# EAGLE schematic os30_master (EAGLE 7.7.0)
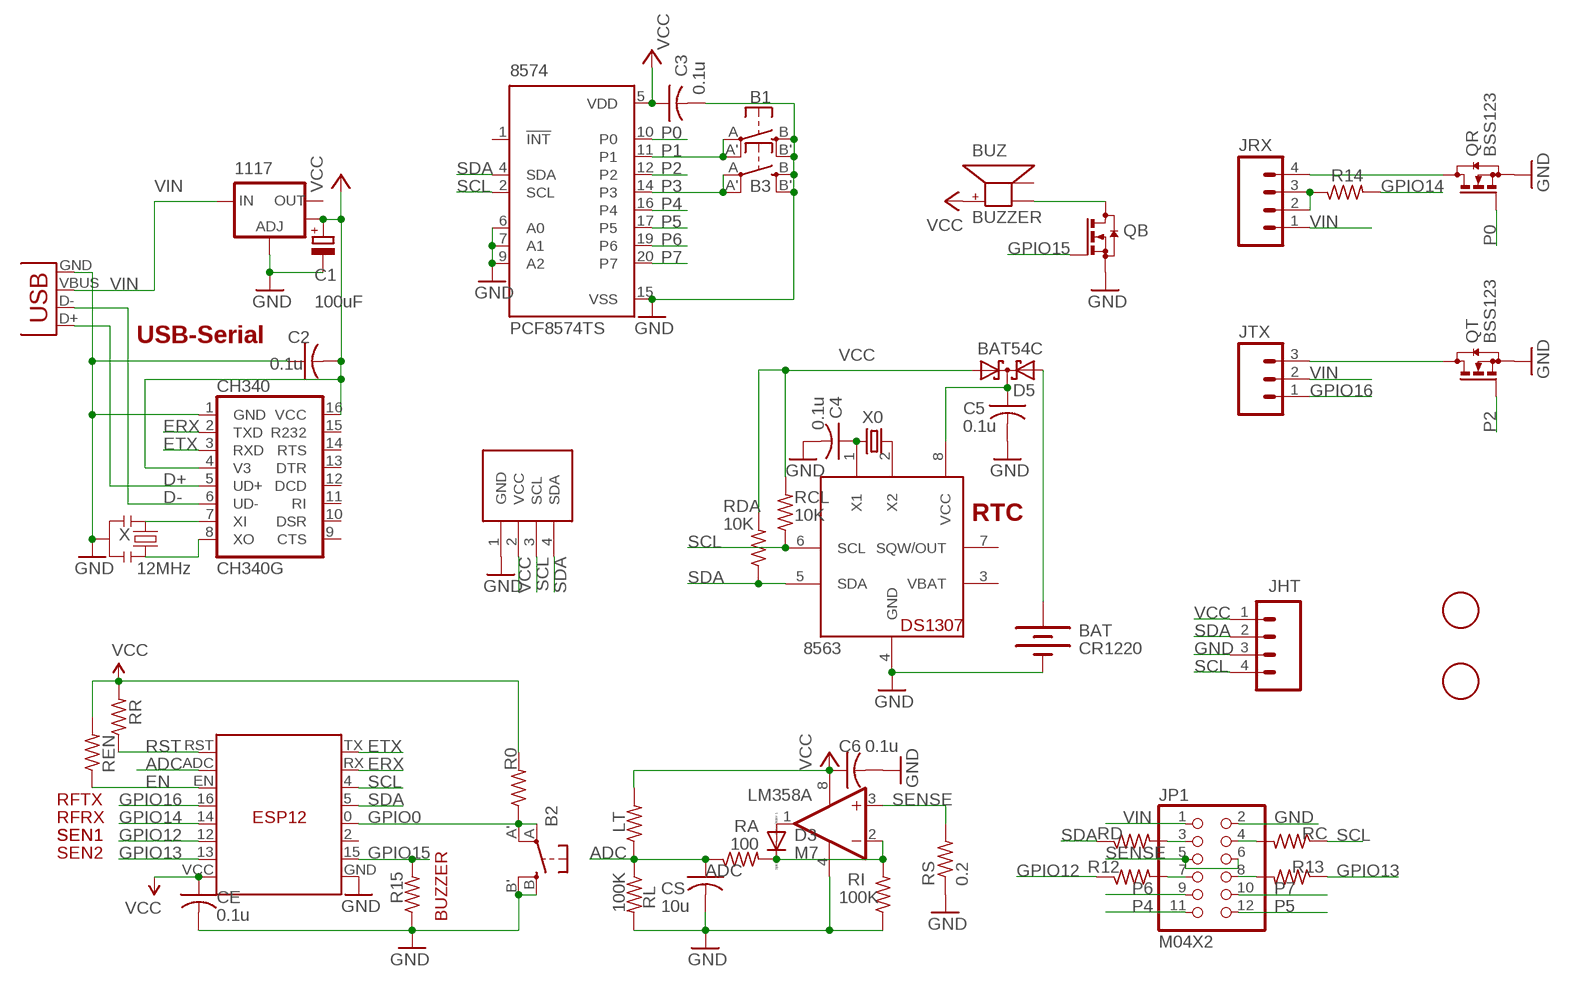
[diagram p0: schematic, sheet 1]

## Parts
1117  V_REG_LM1117SOT223  [SOT223]
8563  PCF8563  DS1307SOIC  [SO08]
8574  PCF8574TS  [SSOP20]
B1  SPST_TACT-EVQQ2  [EVQ-Q2]
B2  SPST_TACT-EVQQ2  [EVQ-Q2]
B3  SPST_TACT-EVQQ2  [EVQ-Q2]
BAT  CR1220  BATTERYBATTERY_12MM_SMT  [BATTCON_12MM_SMT]
BUZ  BUZZER  [SMT-8585-BUZZER]
C1  100uF  CPOL-EUD  [PANASONIC_D]
C2  0.1u  C-USC0603  [C0603]
C3  0.1u  C-USC0603  [C0603]
C4  0.1u  C-USC0603  [C0603]
C5  0.1u  C-USC0603  [C0603]
C6  0.1u  C-USC0603  [C0603]
CE  0.1u  C-USC0603  [C0603]
CH340  CH340G  [SO16]
CS  10u  C-USC0805K  [C0805K]
D3  M7  DIODE-DO-214AC  [DO-214AC]
D5  BAT54C  [SOT23]
ESP  ESP  ESP12ESPWES  [ESP12_WES]
JHT  M04NARROW  [1X04-NARROW]
JP1  M04X2  PINHD-2X6  [2X06]
JRX  M04PTH  [1X04]
JTX  M03PTH  [1X03]
LCD  SSD1306_OLED_I2CSMD3  [SSD1306_OLED_I2C_SMD3]
LM358  OP262D  [SO08]
LT  100K  R-US_R1206  [R1206]
QB  AO3400  BSS123  [SOT23]
QR  BSS123  [SOT23]
QT  BSS123  [SOT23]
R0  10k  R-US_R0603  [R0603]
R12  4.7k  R-US_R0603  [R0603]
R13  4.7k  R-US_R0603  [R0603]
R14  1K  R-US_R0603  [R0603]
R15  10K  R-US_R0603  [R0603]
RA  100  R-US_R0603  [R0603]
RC  4.7k  R-US_R0603  [R0603]
RCL  10K  R-US_R0603  [R0603]
RD  330  R-US_R0603  [R0603]
RDA  10K  R-US_R0603  [R0603]
REN  10k  R-US_R0603  [R0603]
RI  100K  R-US_R0603  [R0603]
RL  100K  R-US_R0603  [R0603]
RR  10k  R-US_R0603  [R0603]
RS  0.2  R-US_R2512  [R2512]
U$1  FIDUCIAL  [FIDUCIAL_1MM]
U$2  FIDUCIAL  [FIDUCIAL_1MM]
USB  USBMICROB2  [USB-MICROB2]
X  12MHz  RESONATORSMD  [RESONATOR-SMD]
X0  32.768kHz  CRYSTALMM20SS1  [MM20SS1]

## Nets
ADC: CS.1 ESP.ADC LT.1 RA.1 RL.1
D+: CH340.5(UD+) USB.D+
D-: CH340.6(UD-) USB.D-
EN: ESP.EN REN.1
ERX: CH340.2(TXD) ESP.RX
ETX: CH340.3(RXD) ESP.TX
GND [power]: 1117.1(ADJ) 8563.4(GND) 8574.6(A0) 8574.7(A1) 8574.9(A2) 8574.15(VSS) B1.B'(S1) B1.B(S) B2.B'(S1) B2.B(S) B3.B'(S1) B3.B(S) BAT.P$1(-) C1.- C2.1 C3.2 C4.2 C5.2 C6.2 CE.2 CH340.1(GND) CS.2 ESP.GND JHT.3 JP1.2 LCD.1(GND) LM358.4(P:V-) QB.2(S) QR.2(S) QT.2(S) R15.1 RI.1 RL.2 RS.1 USB.GND X.2
GPIO0: B2.A'(P1) B2.A(P) ESP.0(G0) R0.1
GPIO12: ESP.12(G12) R12.1
GPIO13: ESP.13(G13) R13.1
GPIO14: ESP.14(G14) R14.2
GPIO15: ESP.15(G15) QB.1(G) R15.2
GPIO16: ESP.16(G16) JTX.1
N$1: 8563.1(X1) C4.1 X0.1
N$2: BUZ.- QB.3(D)
N$3: JP1.3 RD.2
N$4: JP1.4 RC.2
N$5: JP1.7 R12.2
N$6: JP1.8 R13.2
N$7: D3.C LM358.2(A:-IN) RA.2 RI.2
N$17: 8563.8(VCC) C5.1 D5.3(CC)
N$24: CH340.7(XI) X.1
N$26: JRX.2 JRX.3 R14.1
N$28: JTX.3 QT.3(D)
N$29: JRX.4 QR.3(D)
N$30: 8563.2(X2) X0.4
N$36: BAT.P$2(+) D5.2(A2)
N$40: CH340.8(XO) X.3
N$43: D3.A LM358.1(A:OUT)
P0: 8574.10(P0) QR.1(G)
P1: 8574.11(P1) B1.A'(P1) B1.A(P)
P2: 8574.12(P2) QT.1(G)
P3: 8574.14(P3) B3.A'(P1) B3.A(P)
P4: 8574.16(P4) JP1.11
P5: 8574.17(P5) JP1.12
P6: 8574.19(P6) JP1.9
P7: 8574.20(P7) JP1.10
RST: ESP.RST RR.1
SCL: 8563.6(SCL) 8574.2(SCL) ESP.4(G4) JHT.4 LCD.3(SCL) RC.1 RCL.1
SDA: 8563.5(SDA) 8574.4(SDA) ESP.5(G5) JHT.2 LCD.4(SDA) RD.1 RDA.1
SENSE [relaypower]: JP1.5 JP1.6 LM358.3(A:+IN) RS.2
VCC: 1117.4(OUT) 8574.5(VDD) BUZ.+ C1.+ C2.2 C3.1 C6.1 CE.1 CH340.4(V3) CH340.16(VCC) D5.1(A1) ESP.VCC JHT.1 LCD.2(VCC) LM358.8(P:V+) LT.2 R0.2 RCL.2 RDA.2 REN.2 RR.2
VIN [power]: 1117.3(IN) JP1.1 JRX.1 JTX.2 USB.VBUS
Unconnected: 1117.2(OUT) 8563.7(SQW/OUT) 8574.1(!INT) BUZ.A- CH340.9(CTS) CH340.10(DSR) CH340.11(RI) CH340.12(DCD) CH340.13(DTR) CH340.14(RTS) CH340.15(R232) ESP.2(G2) LM358.5(B:+IN) LM358.6(B:-IN) LM358.7(B:OUT)

## Notes on the sheet
- USB-Serial
- RTC
- RFTX
- RFRX
- SEN1 | SEN1
- SEN2
- BUZZER

## Power pins joined to a net without a drawn wire
VBAT: 8563.3(VBAT)

## Library data of the parts
1117 = SparkFun:V_REG_LM1117: Voltage Regulator LM1117 Standard adjustable voltage regulator but in SMD form. Spark Fun Electronics SKU : COM-00595
8563 = adafruit:DS1307: DS1307 Real time clock (RTC) with battery backup ability. Talk to it via i2c
8574 = micro-philips:PCF8574: I2C-Bus Remote 8-bit I/O expander http://www.semiconductors.philips.com/acrobat_download/datasheets/PCF8574_4.pdf; MPN: PCF8574TS/3,118; OC_FARNELL: 1506644; OC_NEWARK: 70R6873
B1-B3 = adafruit_3:SPST_TACT: SMT 6mm switch, EVQQ2 series http://www.ladyada.net/library/eagle
BAT = SparkFunNew:BATTERY: Battery Holders Various common sizes : AA, AAA, 20mm coin cell and 12mm coin cell.
BUZ = adafruit:BUZZER
C1 = resistor:CPOL-EU: POLARIZED CAPACITOR, European symbol
C2-C6 CE CS = adafruit:C-US: CAPACITOR, American symbol
CH340 = SparkFunNew:CH340
D3 = diode:DIODE-: DIODE
D5 = diode:BAT54C: Schottky Diodes Source: Fairchild .. BAT54.pdf
ESP = JeeParts:ESP12
JHT JRX = SparkFun:M04: Header 4 Standard 4-pin 0.1" header. Use with straight break away headers (SKU : PRT-00116), right angle break away headers (PRT-00553), swiss pins (PRT-00743), machine pins (PRT-00117), and female headers (PRT-00115). Molex polarized connector foot print use with SKU : PRT-08231 with associated crimp pins and housings.
JP1 = pinhead:PINHD-2X6: PIN HEADER
JTX = SparkFun:M03: Header 3 Standard 3-pin 0.1" header. Use with straight break away headers (SKU : PRT-00116), right angle break away headers (PRT-00553), swiss pins (PRT-00743), machine pins (PRT-00117), and female headers (PRT-00115). Molex polarized connector foot print use with SKU : PRT-08232 with associated crimp pins and housings.
LCD = adafruit2013:SSD1306_OLED_I2C
LM358 = linear:OP262: OP AMP
LT R15 RA RCL RDA RI RL RS = adafruit2013:R-US_: RESISTOR, American symbol
QB QR QT = transistor-small-signal:BSS123: N-CHANNEL MOS FET
R0 REN RR = adafruit:R-US_: RESISTOR, American symbol
R12-R14 RC RD = adafruitGood:R-US_: RESISTOR, American symbol
U$1 U$2 = adafruitGood:FIDUCIAL: For use by pick and place machines to calibrate the vision/machine, 1mm By microbuilder.eu
USB = SparkFunNew:USB: USB Connectors USB-B-PTH is fully proven SKU : PRT-00139 USB-miniB is fully proven SKU : PRT-00587 USB-A-PCB is untested. USB-A-H is throughly reviewed, but untested. Spark Fun Electronics SKU : PRT-00437 USB-B-SMT is throughly reviewed, but untested. Needs silkscreen touching up. USB-A-S has not been used/tested USB-MB-H has not been used/tested
X = SparkFunNew:RESONATOR: Resonator Small SMD resonator. This is the itty bitty 10/20MHz resonators with built in caps. CSTCE10M0G55 and CSTCE20M0V53. Footprint has been reviewed closely but hasn't been tested yet.
X0 = crystal:CRYSTAL: CRYSTAL

## Net classes
0 default: width 0.203 mm, clearance 0.178 mm
1 power: width 0.254 mm, clearance 0.203 mm
2 relaypower: width 0.813 mm, clearance 0.305 mm